# EAGLE design MicroLock_Breakout (EAGLE 9.6.2)
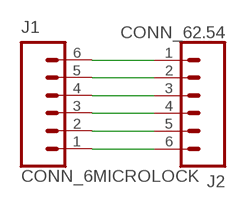
[diagram p0: schematic, sheet 1]

## Parts
J1  CONN_6MICROLOCK  [1X06_MICROLOCKPLUS]
J2  CONN_62.54  [1X06]

## Nets
N$1: J1.2 J2.5
N$2: J1.1 J2.6
N$3: J1.3 J2.4
N$4: J1.4 J2.3
N$5: J1.5 J2.2
N$6: J1.6 J2.1

## Library data of the parts
J1 = bschulz:CONN_6: Genaric 6 terminal header Digikey 2.54_SCREW <https://www.digikey.com/product-detail/en/on-shore-technology-inc/OSTVN06A150/ED10565-ND/1588866>; DIGIKEY: 900-2059570671CT-ND; MF: Molex; MPN: 2059570671
J2 = bschulz:CONN_6: Genaric 6 terminal header Digikey 2.54_SCREW <https://www.digikey.com/product-detail/en/on-shore-technology-inc/OSTVN06A150/ED10565-ND/1588866>

## Board
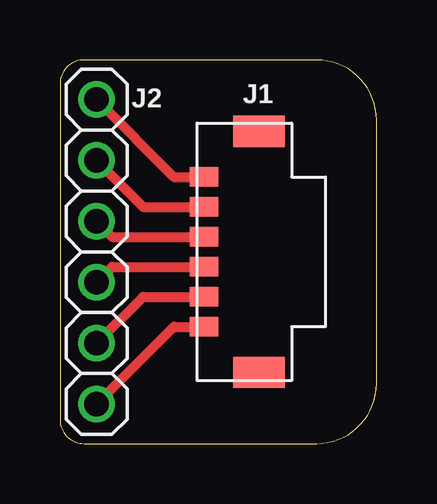
[diagram p1: board, top side]

Size 13.19 x 16 mm. Coordinates in mm from the lower left corner, seen from the top.
Outline: 10.69,16 1,16 arc90 0,15 0,1 arc90 1,0 10.69,0 arc90 13.19,2.5 13.19,13.5 arc90 10.69,16
Copper layers (1*16): Top 0.035559375mm / dielectric 1.6mm / Bottom 0.035559375mm
Design rules "oshpark-2layer": minimum track width 6mil, minimum drill 10mil, track to track 6mil, track to pad 6mil, pad to pad 6mil, via to via 6mil, smd to smd 6mil, copper to edge 15mil, drill to drill 6mil, minimum pad ring 5mil, minimum via ring 5mil, stop-mask expansion 2.5mil, vias tented up to drill 0mil, thermal gap 10mil

### Footprints (pad centres in the part's own frame; a part is rotated, then mirrored left to right if it is on the bottom)
1X06_MICROLOCKPLUS = smd 0.8 x 1.2: 1 -3.125,-0.6; 2 -1.875,-0.6; 3 -0.625,-0.6; 4 0.625,-0.6; 5 1.875,-0.6; 6 3.125,-0.6 | smd 1.3 x 2.15: BODY@1 -5.025,1.695; BODY@2 5.025,1.695
1X06 = drill 1.016: 1 -6.35,0; 2 -3.81,0; 3 -1.27,0; 4 1.27,0; 5 3.81,0; 6 6.35,0

### Placement (x,y rotation side)
J1  6.6,8 270 top
J2  1.52,8 90 top

### Tracks (layer width: path | path; a pad name or v marks a point on that pad's centre or on a via)
N$1
  Top 0.406: J2.5 3.46,9.88 J1.2
N$2
  Top 0.406: J2.6 4.75,11.12 J1.1
N$3
  Top 0.406: J2.4 2.17,8.62 J1.3
N$4
  Top 0.406: J2.3 2.17,7.38 J1.4
N$5
  Top 0.406: J2.2 3.46,6.12 J1.5
N$6
  Top 0.406: J2.1 4.75,4.88 J1.6

### Text on the board
bDocu: Break44 / MicroLock Breakout / B. Schulz